# EAGLE design kwartzclock (EAGLE 9.5.2)
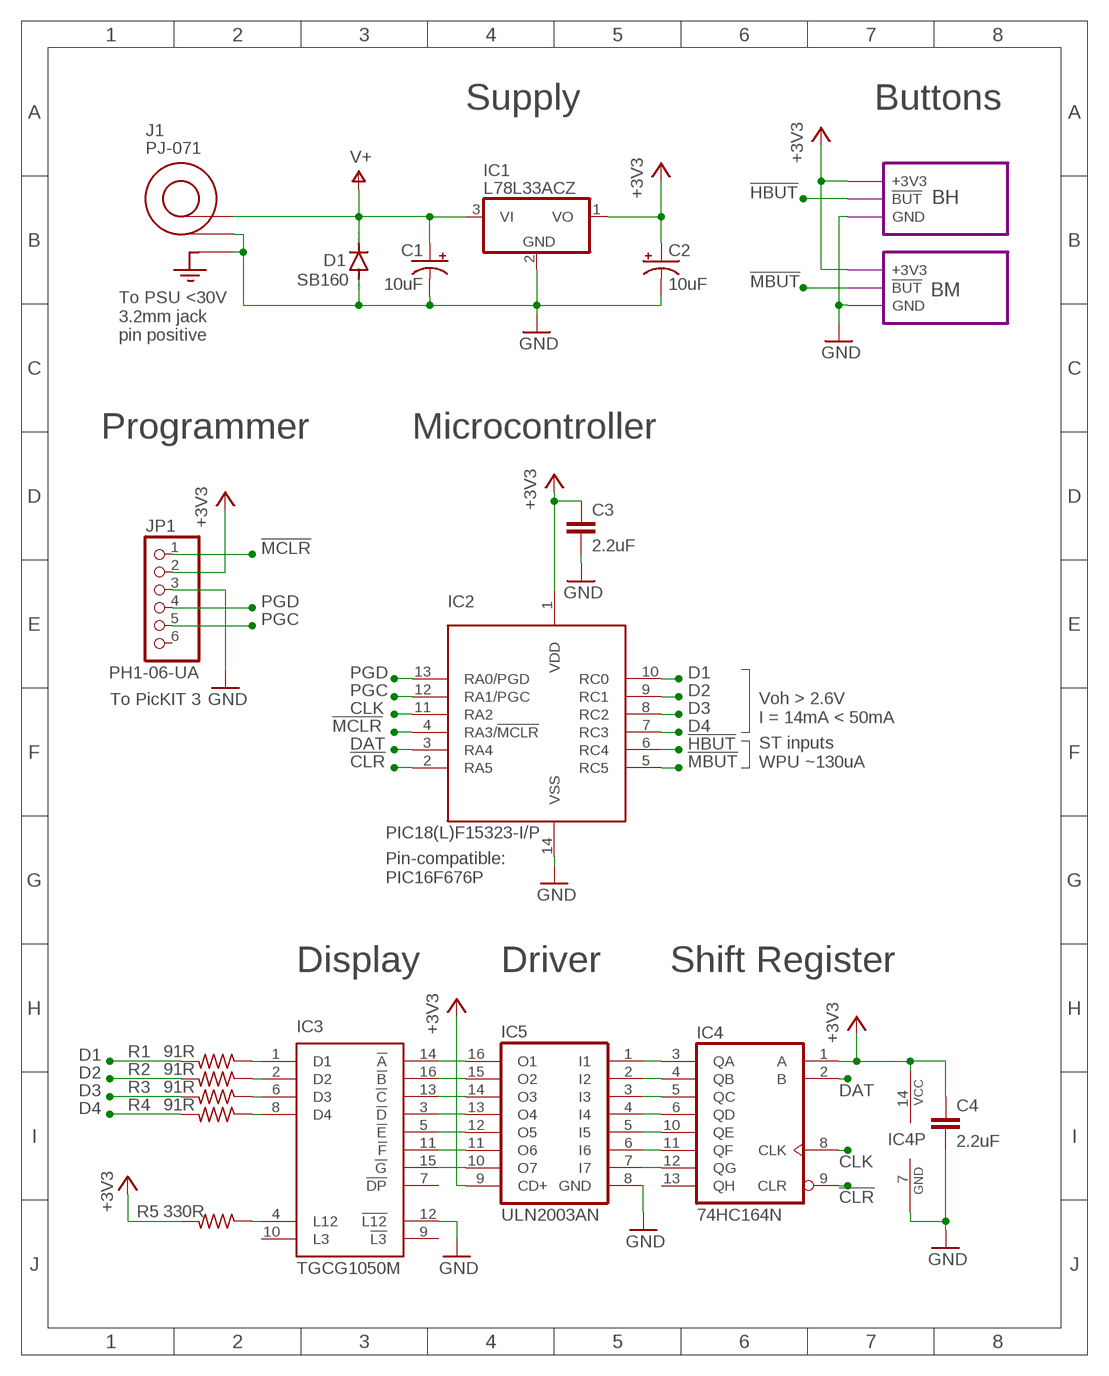
[diagram p0: schematic, sheet 1]

## Parts
C1  10uF  CPOL-USE2.5-6  [E2,5-6]
C2  10uF  CPOL-USE2.5-6  [E2,5-6]
C3  2.2uF  C-EU050-024X044  [C050-024X044]
C4  2.2uF  C-EU050-024X044  [C050-024X044]
D1  SB160  SB120  [DO41-10]
IC1  L78L33ACZ  78L05Z  [TO92]
IC2  PIC18(L)F15323-I/P  [DIL14]
IC3  TGCG1050M  TGC1050M  [DIP16-WIDE]
IC4  74HC164N  [DIL14]
IC5  ULN2003AN  [DIL16]
J1  PJ-071  [PJ-071]
JP1  PH1-06-UA  PINHD-1X6  [1X06]
R1  91R  R-US_0207/7  [0207/7]
R2  91R  R-US_0207/7  [0207/7]
R3  91R  R-US_0207/7  [0207/7]
R4  91R  R-US_0207/7  [0207/7]
R5  330R  R-US_0207/7  [0207/7]

## Module instances
BH = BUTTON
BM = BUTTON

## Nets
!CLR: IC2.2(RA5) IC4.9(CLR)
!DRVA: IC3.14(!A) IC5.16(O1)
!DRVB: IC3.16(!B) IC5.15(O2)
!DRVC: IC3.13(!C) IC5.14(O3)
!DRVD: IC3.3(!D) IC5.13(O4)
!DRVE: IC3.5(!E) IC5.12(O5)
!DRVF: IC3.11(!F) IC5.11(O6)
!DRVG: IC3.15(!G) IC5.10(O7)
!HBUT: IC2.6(RC4) ; port BH.!BUT
!MBUT: IC2.5(RC5) ; port BM.!BUT
!MCLR: IC2.4(RA3/!MCLR) JP1.1
+3V3 [power]: C2.+ C3.1 C4.1 IC1.1(VO) IC2.1(VDD) IC4.1(A) IC4.14(VCC) IC5.9(CD+) JP1.2 R5.2 ; port BH.+3V3 BM.+3V3
CLK: IC2.11(RA2) IC4.8(CLK)
D1: IC2.10(RC0) R1.2
D1LIM: IC3.1(D1) R1.1
D2: IC2.9(RC1) R2.2
D2LIM: IC3.2(D2) R2.1
D3: IC2.8(RC2) R3.2
D3LIM: IC3.6(D3) R3.1
D4: IC2.7(RC3) R4.2
D4LIM: IC3.8(D4) R4.1
DAT: IC2.3(RA4) IC4.2(B)
GND [power]: C1.- C2.- C3.2 C4.2 D1.A IC1.2(GND) IC2.14(VSS) IC3.12(!L12) IC4.7(GND) IC5.8(GND) J1.2(OUTER) J1.3(SHIELD) J1.4(SHIELD) JP1.3 ; port BM.GND BH.GND
L12LIM: IC3.4(L12) R5.1
PGC: IC2.12(RA1/PGC) JP1.5
PGD: IC2.13(RA0/PGD) JP1.4
SRA: IC4.3(QA) IC5.1(I1)
SRB: IC4.4(QB) IC5.2(I2)
SRC: IC4.5(QC) IC5.3(I3)
SRD: IC4.6(QD) IC5.4(I4)
SRE: IC4.10(QE) IC5.5(I5)
SRF: IC4.11(QF) IC5.6(I6)
SRG: IC4.12(QG) IC5.7(I7)
V+ [power]: C1.+ D1.C IC1.3(VI) J1.1(INNER)
Unconnected: IC3.7(!DP) IC3.9(!L3) IC3.10(L3) IC4.13(QH) JP1.6

## Notes on the sheet
- Supply | Buttons
- To PSU <30V
  3.2mm jack
  pin positive
- Programmer | Microcontroller
- To PicKIT 3
- Voh > 2.6V
  I = 14mA < 50mA
- ST inputs
  WPU ~130uA
- Pin-compatible:
  PIC16F676P
- Display | Driver | Shift Register

## Library data of the parts
C1 C2 = rcl:CPOL-US: POLARIZED CAPACITOR, American symbol; SPICEPREFIX: C
C3 C4 = rcl:C-EU: CAPACITOR, European symbol; SPICEPREFIX: C
D1 = diode:SB120: DIODE barrier rectifier, 1 A (Fairchild)
IC1 = linear:78*: Positive VOLTAGE REGULATOR Source: http://cache.national.com/ds/LM/LM78L05.pdf http://www.fairchildsemi.com/ds/LM/LM7805.pdf
IC2 = PIC18LF15323:PIC18(L)F15323
IC3 = vishay-7seg:TGC*1050M
IC4 = 74xx-us:74*164: 8-bit parallel out SHIFT REGISTER
IC5 = uln-udn:ULN2003A: DRIVER ARRAY
J1 = cui-jacks:PJ-071
JP1 = pinhead:PINHD-1X6: PIN HEADER
R1-R5 = rcl:R-US_: RESISTOR, American symbol; SPICEPREFIX: R

## Module BUTTON
Ports: !BUT(out) +3V3(pwr) GND(pwr)
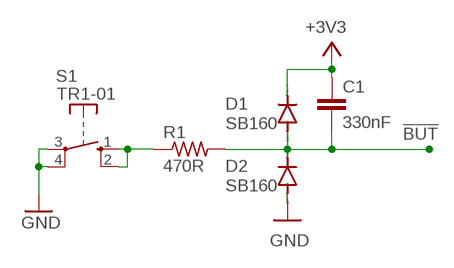
[diagram p1: schematic, module BUTTON, sheet 1]

### Parts
C1  330nF  C-EU050-024X044  [C050-024X044]
D1  SB160  SB120  [DO41-10]
D2  SB160  SB120  [DO41-10]
R1  470R  R-US_0207/7  [0207/7]
S1  TR1-01  DTE6  [DTE6]

### Nets
!BUT: C1.2 D1.A D2.C R1.2
!BUT_IN: R1.1 S1.1(S) S1.2(S)
+3V3: C1.1 D1.C
GND: D2.A S1.3(P) S1.4(P)

### Library data of the parts
C1 = rcl:C-EU: CAPACITOR, European symbol; SPICEPREFIX: C
D1 D2 = diode:SB120: DIODE barrier rectifier, 1 A (Fairchild)
R1 = rcl:R-US_: RESISTOR, American symbol; SPICEPREFIX: R
S1 = switch-misc:DT: ITT SWITCH

## Net classes
0 default: width 0.305 mm, clearance 0.356 mm
1 power: width 0.305 mm, clearance 0.356 mm

## Board
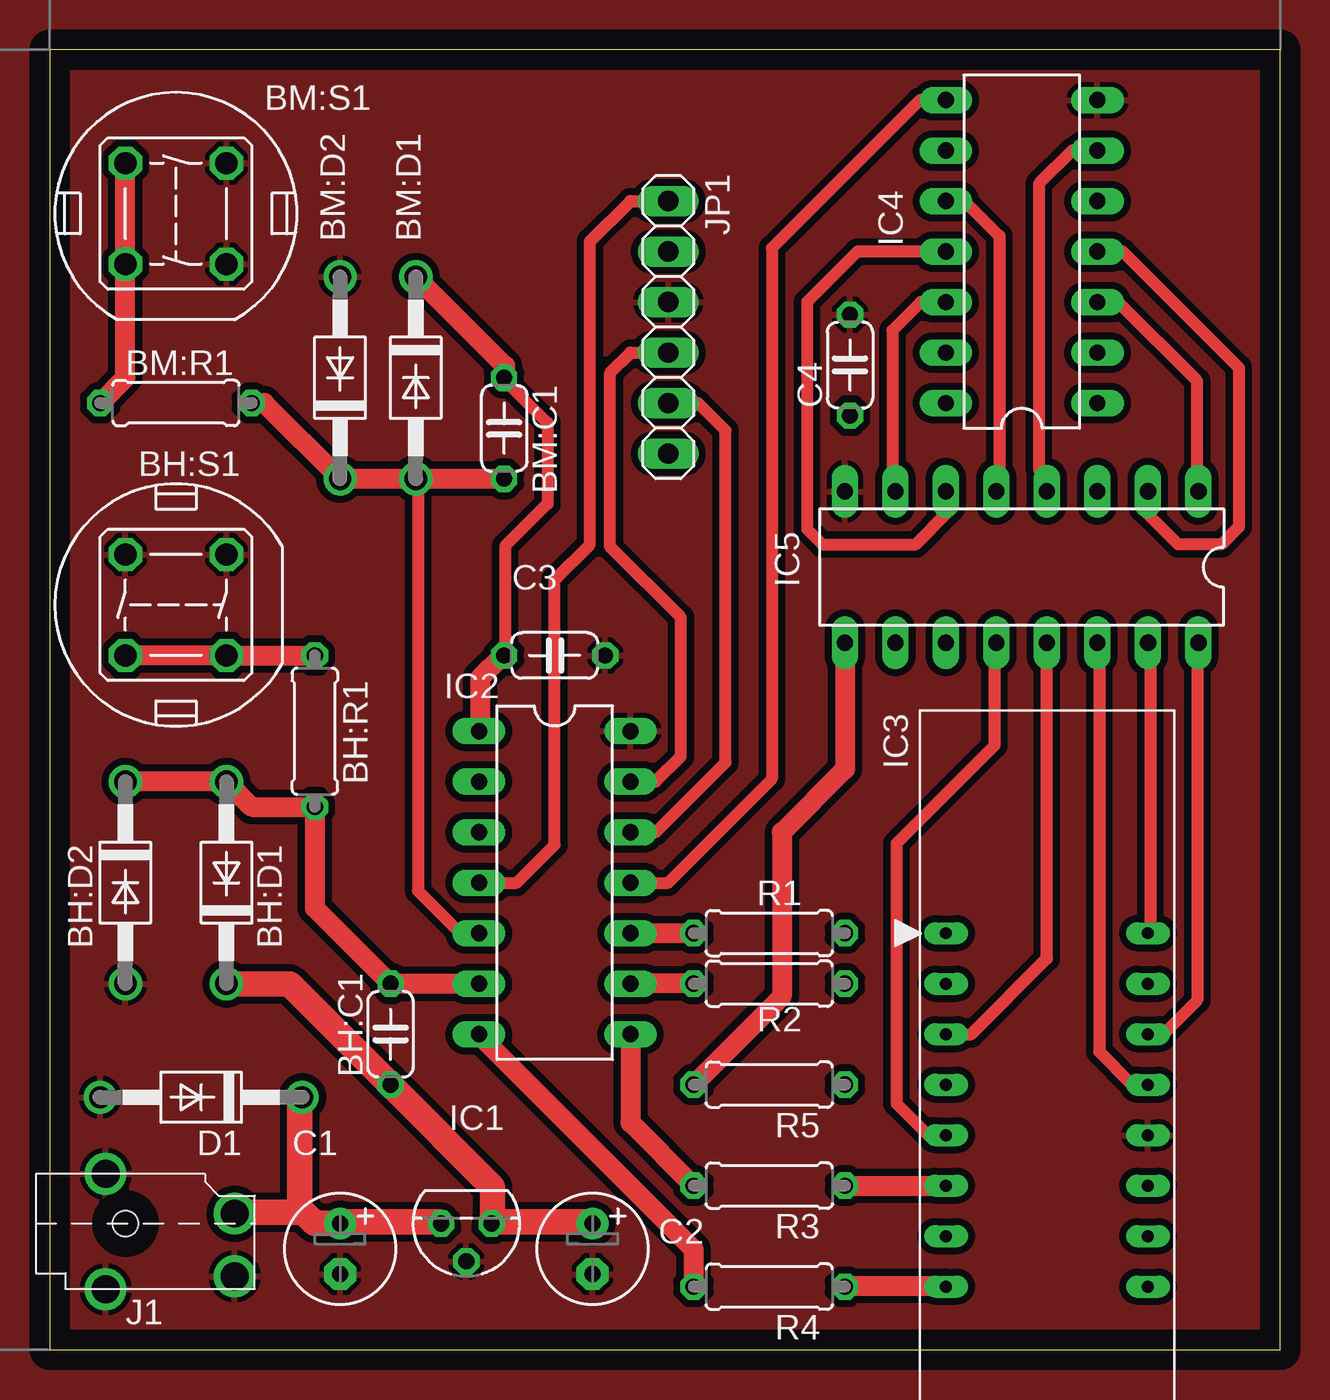
[diagram p2: board, top side]
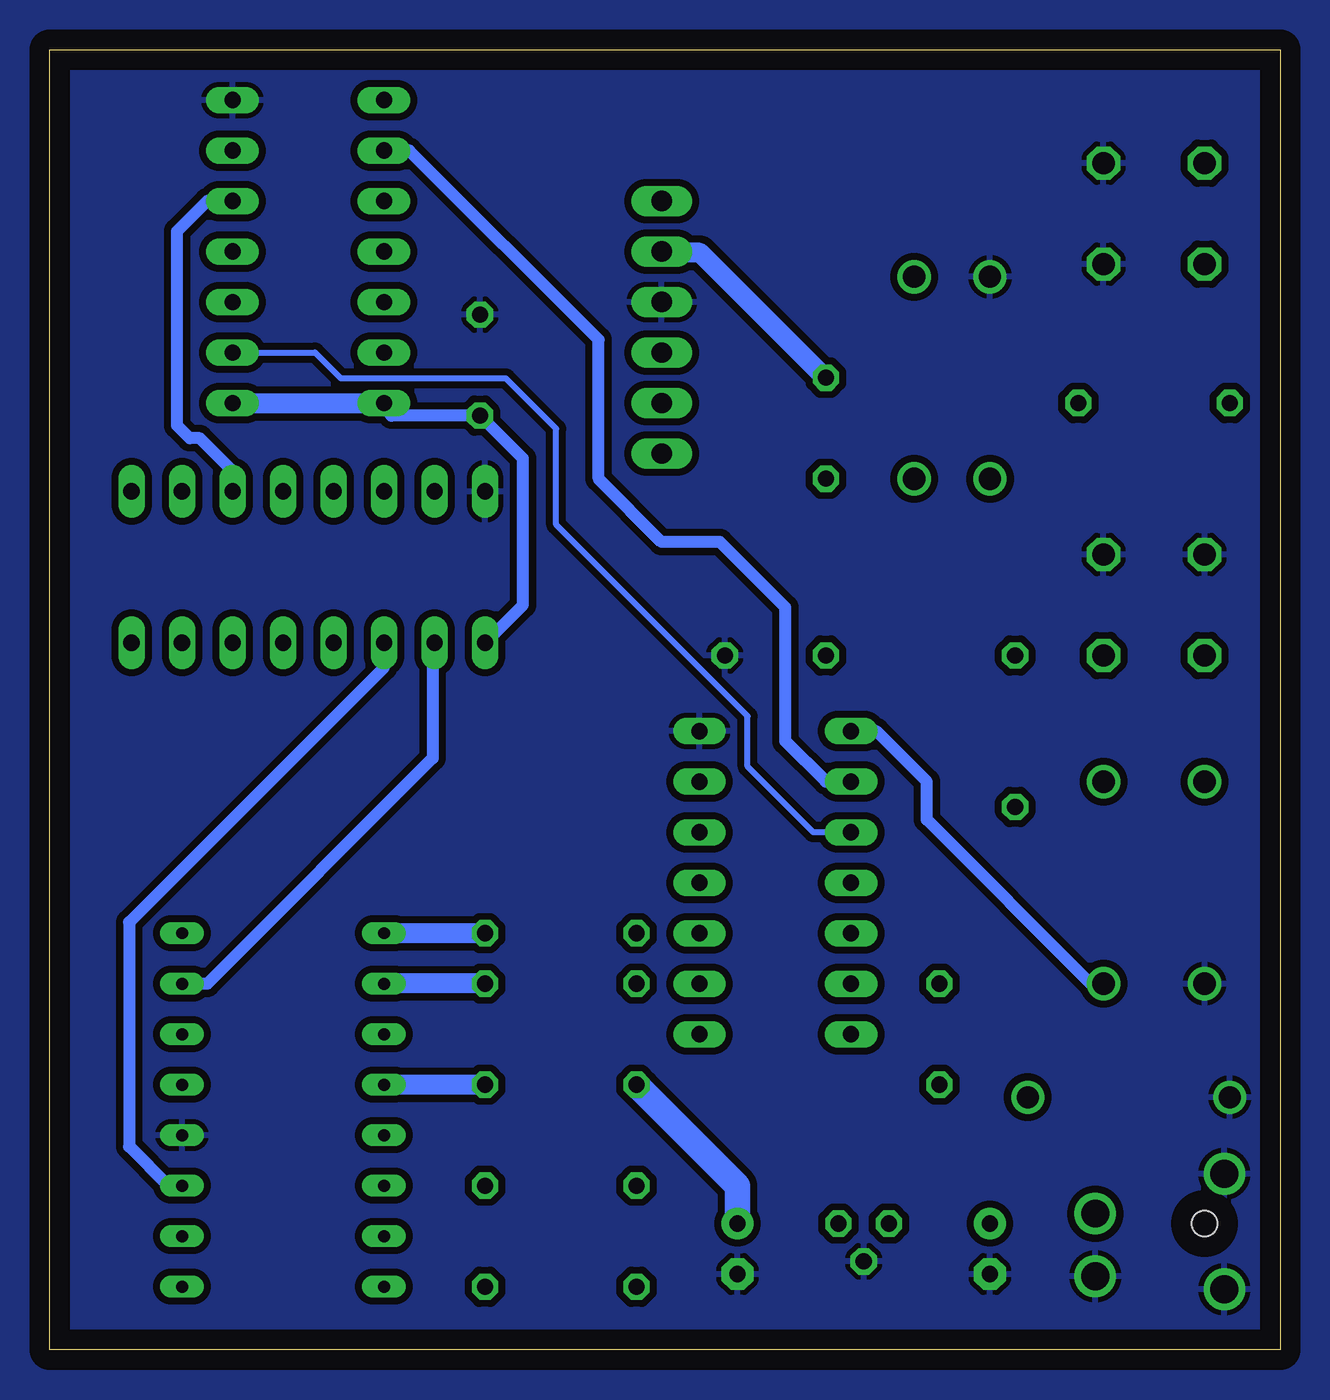
[diagram p3: board, bottom side, seen from below]

Size 61.9 x 65.39 mm. Coordinates in mm from the lower left corner, seen from the top.
Outline: 0,0 61.9,0 61.9,65.39 0,65.39 0,0
Copper layers (1*16): Top 0.035mm / dielectric 1.5mm / Bottom 0.035mm
Design rules "default *": minimum track width 12mil, minimum drill 0.35mm, track to track 14mil, track to pad 14mil, pad to pad 14mil, via to via 14mil, smd to smd 14mil, copper to edge 40mil, drill to drill 6mil, minimum pad ring 10mil, minimum via ring 8mil, stop-mask expansion 4mil, vias tented up to drill 0mil, thermal gap 10mil

### Footprints (pad centres in the part's own frame; a part is rotated, then mirrored left to right if it is on the bottom)
C050-024X044 = drill 0.813 octagon: 1 -2.54,0; 2 2.54,0
DO41-10 = drill 1.118: A 5.08,0; C -5.08,0
0207/7 = drill 0.813 octagon: 1 -3.81,0; 2 3.81,0
DTE6 = drill 1.118 octagon: 1 -2.54,2.54; 2 2.54,2.54; 3 2.54,-2.54; 4 -2.54,-2.54
E2,5-6 = drill 0.813 pad 1.6: + -1.27,0 | drill 0.813 pad 1.6 octagon: - 1.27,0
TO92 = drill 0.813 octagon: 1 -1.27,0; 2 0,1.905; 3 1.27,0
DIL14 = drill 0.813 long: 1 -7.62,-3.81; 2 -5.08,-3.81; 3 -2.54,-3.81; 4 0,-3.81; 5 2.54,-3.81; 6 5.08,-3.81; 7 7.62,-3.81; 8 7.62,3.81; 9 5.08,3.81; 10 2.54,3.81; 11 0,3.81; 12 -2.54,3.81; 13 -5.08,3.81; 14 -7.62,3.81
DIP16-WIDE = drill 0.6 long: 1 -8.89,-5.08; 2 -6.35,-5.08; 3 -3.81,-5.08; 4 -1.27,-5.08; 5 1.27,-5.08; 6 3.81,-5.08; 7 6.35,-5.08; 8 8.89,-5.08; 9 8.89,5.08; 10 6.35,5.08; 11 3.81,5.08; 12 1.27,5.08; 13 -1.27,5.08; 14 -3.81,5.08; 15 -6.35,5.08; 16 -8.89,5.08
DIL16 = drill 0.813 long: 1 -8.89,-3.81; 2 -6.35,-3.81; 3 -3.81,-3.81; 4 -1.27,-3.81; 5 1.27,-3.81; 6 3.81,-3.81; 7 6.35,-3.81; 8 8.89,-3.81; 9 8.89,3.81; 10 6.35,3.81; 11 3.81,3.81; 12 1.27,3.81; 13 -1.27,3.81; 14 -3.81,3.81; 15 -6.35,3.81; 16 -8.89,3.81
PJ-071 = drill 1.4: 1 5.5,0.5; 2 5.5,-2.65; 3 -1,-3.3; 4 -1,2.5 | hole 1.3: 0,0
1X06 = drill 1.016 long: 1 -6.35,0; 2 -3.81,0; 3 -1.27,0; 4 1.27,0; 5 3.81,0; 6 6.35,0

### Placement (x,y rotation side)
BH:C1  330nF  [C050-024X044]  17.14,15.88 90 top
BH:D1  SB160  [DO41-10]  8.89,23.5 90 top
BH:D2  SB160  [DO41-10]  3.81,23.5 270 top
BH:R1  470R  [0207/7]  13.34,31.11 270 top
BH:S1  TR1-01  [DTE6]  6.35,37.47 180 top
BM:C1  330nF  [C050-024X044]  22.86,46.35 270 top
BM:D1  SB160  [DO41-10]  18.41,48.9 270 top
BM:D2  SB160  [DO41-10]  14.61,48.9 90 top
BM:R1  470R  [0207/7]  6.35,47.62 0 top
BM:S1  TR1-01  [DTE6]  6.35,57.15 90 top
C1  14.61,5.08 270 top
C2  27.3,5.08 270 top
C3  25.4,34.92 0 top
C4  40.26,49.53 90 top
D1  7.62,12.7 180 top
IC1  20.95,6.35 180 top
IC2  25.4,23.5 270 top
IC3  50.16,12.06 270 top
IC4  48.9,55.24 90 top
IC5  48.9,39.37 180 top
J1  3.81,6.35 0 top
JP1  31.11,51.44 270 top
R1  36.2,20.95 180 top
R2  36.2,18.41 180 top
R3  36.2,8.26 180 top
R4  36.2,3.17 180 top
R5  36.2,13.34 180 top

### Tracks (layer width: path | path; a pad name or v marks a point on that pad's centre or on a via)
!CLR
  Bottom 0.61: IC2.2 22.86,28.57 24.89,30.61 24.89,37.34 28.19,40.64 31.11,40.64 34.29,43.81 34.29,50.8 43.81,60.33 IC4.9
!DRVA
  Top 0.305: 57.72,35.53 IC5.16
  Top 0.61: IC3.14 56.02,15.88 57.72,17.58 57.72,35.53
!DRVB
  Top 0.305: 55.36,20.95 IC3.16
  Top 0.61: IC5.15 55.36,35.45 55.36,20.95
!DRVC
  Top 0.61: IC3.13 54.46,13.34 52.79,15 52.79,35.47 IC5.14
!DRVD
  Top 0.61: IC3.3 46.35,15.88 50.16,19.68 IC5.13
!DRVE
  Top 0.305: 47.52,35.53 IC5.12
  Top 0.61: IC3.5 44.2,10.79 42.6,12.39 42.6,25.48 47.52,30.4 47.52,35.53
!DRVF
  Bottom 0.61: IC3.11 55.94,8.26 57.91,10.22 57.91,21.5 45.09,34.33 IC5.11
!DRVG
  Bottom 0.61: IC3.15 53.98,18.41 42.63,29.76 42.63,35.53 IC5.10
!HBUT
  Top 1.016: BH:D2.C BH:D1.A 10.16,27.3 BH:R1.2 13.34,22.23 BH:C1.2 IC2.6
!MBUT
  Top 0.61: IC2.5 20.66,20.95 18.53,23.09 18.53,43.7 BM:D1.A
  Top 1.016: BM:C1.2 BM:D1.A BM:D2.C 10.79,47.62 BM:R1.2
!MCLR
  Top 0.61: IC2.4 23.5,23.5 25.4,25.4 25.4,38.73 27.18,40.51 27.18,55.75 29.21,57.78 JP1.1
+3V3
  Top 0.305: 22.28,6.43 IC1.1 | 21.65,31.15 IC2.1 | 22.77,34.92 C3.1 22.91,35.06 | 22.91,48.76 BM:C1.1
  Top 0.61: 22.91,35.06 22.91,40.42 25.04,42.56 25.04,46.62 22.91,48.76
  Top 1.016: 21.65,31.15 21.65,33.81 22.77,34.92 | IC5.9 40.01,29.21 36.83,26.04 36.83,17.78 R5.2 | BM:D1.C 22.91,49.48 22.91,48.76
  Top 1.27: 22.28,6.43 27.3,6.43 C2.+ | IC1.1 22.28,6.57 22.28,8.18 BH:C1.1 12.06,18.41 BH:D1.C
  Bottom 0.305: 52.69,47.6 IC4.1 | 45.15,47.6 IC4.14 | 31.06,55.18 JP1.2
  Bottom 0.61: BH:D1.C 9.53,18.41 17.78,26.67 17.78,28.57 20.32,31.11 IC2.1 | IC5.9 38.1,37.47 38.1,44.83 C4.1 44.7,46.99 45.09,47.37 IC4.14
  Bottom 1.016: 45.15,47.6 52.69,47.6 | 31.06,55.18 29.2,55.18 22.91,48.9 BM:C1.1
  Bottom 1.27: R5.2 27.3,8.26 C2.+
BH:!BUT_IN
  Top 1.016: BH:S1.2 BH:S1.1 BH:R1.1
BM:!BUT_IN
  Top 1.016: BM:R1.1 3.81,48.9 BM:S1.1 BM:S1.2
CLK
  Top 0.305: 43.81,62.87 43.74,62.83
  Top 0.61: IC2.11 31.1,23.5 36.32,28.71 36.32,55.41 43.74,62.83 | 43.81,62.87 IC4.8
D1
  Top 1.016: R1.2 IC2.10
D1LIM
  Bottom 1.016: R1.1 IC3.1
D2
  Top 0.305: 29.34,18.44 IC2.9 | 32.31,18.44 R2.2
  Top 1.016: 32.31,18.44 29.34,18.44
D2LIM
  Bottom 0.305: 45.02,18.44 IC3.2 | 40.13,18.44 R2.1
  Bottom 1.016: 40.13,18.44 45.02,18.44
D3
  Top 1.016: IC2.8 29.21,11.43 R3.2
D3LIM
  Top 0.305: 45.02,8.24 IC3.6 | 40.13,8.24 R3.1
  Top 1.016: 40.13,8.24 45.02,8.24
D4
  Top 1.016: R4.2 32.38,5.05 21.59,15.85 IC2.7
D4LIM
  Top 0.305: 45.02,3.21 IC3.8 | 40.13,3.21 R4.1
  Top 1.016: 40.13,3.21 45.02,3.21
DAT
  Bottom 0.305: IC4.2 48.55,50.16 47.26,48.87 38.96,48.87 36.42,46.33 36.42,41.5 26.8,31.88 26.8,29.34 23.5,26.04 IC2.3
GND
  pour Top: -3.81,69.22 -3.81,68.58 -3.81,-3.17 64.77,-3.17 64.77,69.22
  pour Bottom: -2.54,67.94 -2.54,67.31 -2.54,-4.45 66.04,-4.45 66.04,67.94
L12LIM
  Bottom 1.016: R5.1 IC3.4
PGC
  Top 0.61: IC2.12 30.48,26.04 34,29.55 34,46.23 32.6,47.62 JP1.5
PGD
  Top 0.61: IC2.13 30.48,28.57 31.75,29.84 31.75,36.83 28.19,40.39 28.19,49.15 29.21,50.16 JP1.4
SRA
  Top 0.305: 57.72,43.22 IC5.1
  Top 0.61: IC4.3 53.73,52.7 57.72,48.72 57.72,43.22
SRB
  Top 0.61: IC4.4 53.98,55.24 59.82,49.4 59.82,41.4 58.93,40.51 56.77,40.51 55.24,42.04 IC5.2
SRC
  Bottom 0.61: IC4.5 53.98,57.78 55.5,56.26 55.5,46.49 54.85,45.85 54.36,45.85 52.7,44.2 IC5.3
SRD
  Top 0.305: 50.04,44.01 50.04,43.22
  Top 0.61: 50.04,44.01 49.76,44.28 49.76,58.65 51.44,60.33 IC4.6 | 50.04,43.22 IC5.4
SRE
  Top 0.61: IC4.10 46.01,57.78 47.78,56.02 47.78,43.33 IC5.5
SRF
  Top 0.305: 45.15,43.22 IC5.6
  Top 0.61: IC4.11 40.64,55.24 38.1,52.7 38.1,41.27 38.86,40.51 43.56,40.51 45.15,42.1 45.15,43.22
SRG
  Top 0.61: IC5.7 42.38,43.34 42.38,51.27 43.81,52.7 IC4.12
V+
  Top 0.305: J1.1 9.31,6.92 | 12.7,6.92 12.63,6.92 12.57,6.98
  Top 1.27: IC1.3 19.62,6.43 14.73,6.43 C1.+ 13.34,6.35 12.76,6.92 12.7,6.92 | 12.57,6.98 12.57,12.57 D1.C | 9.31,6.92 12.63,6.92